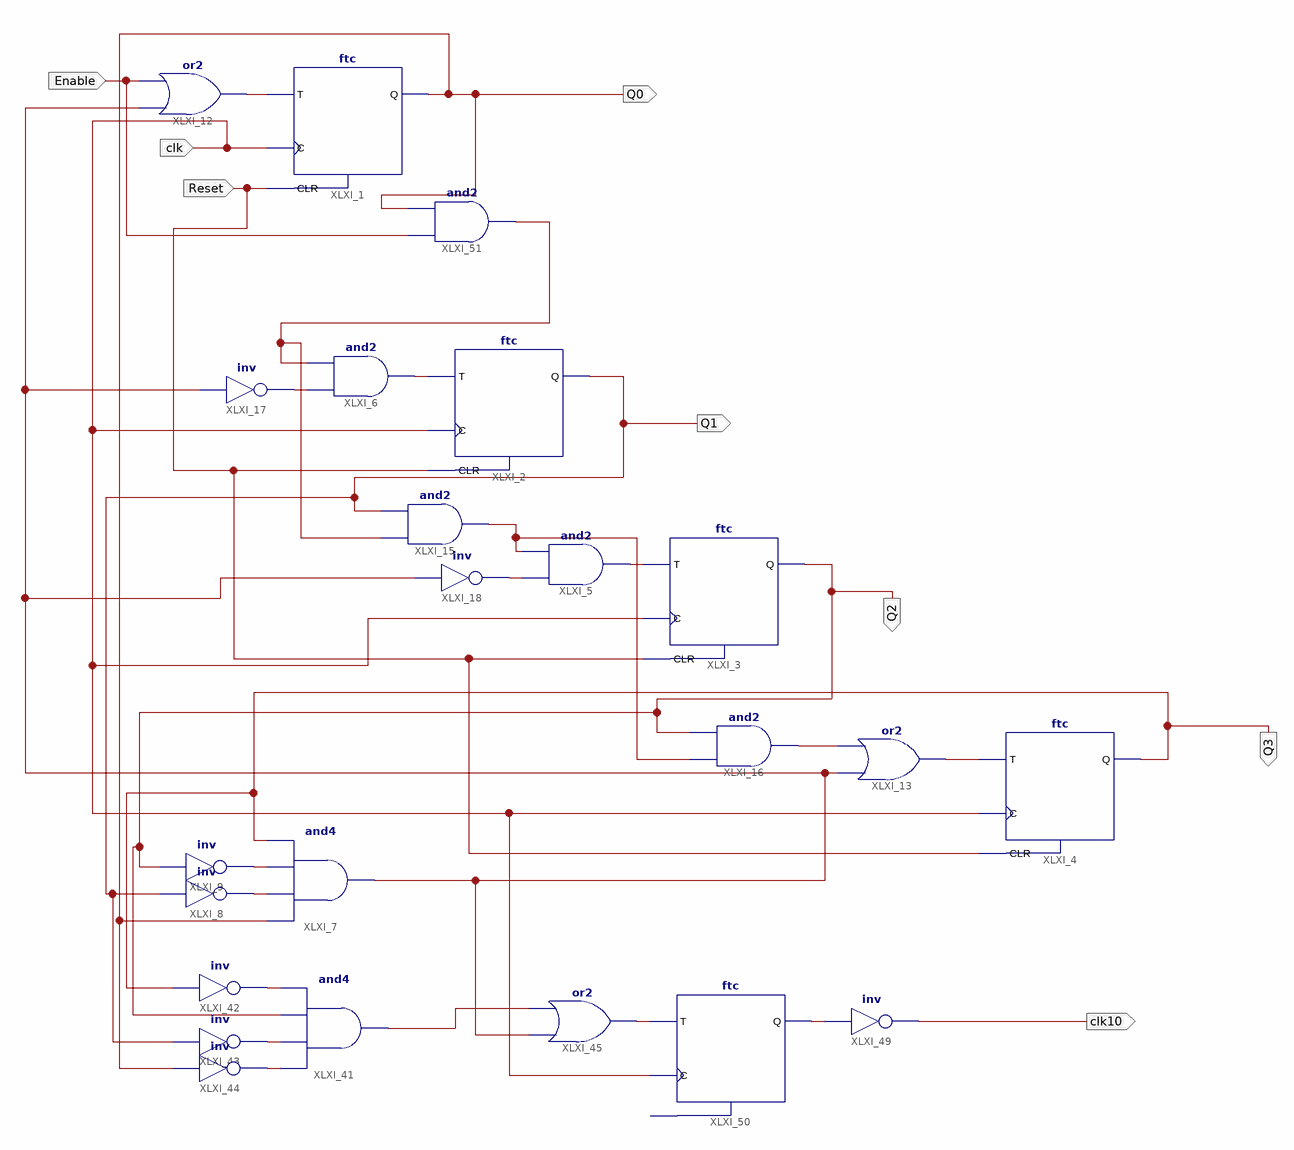
[diagram p0: schematic sheet 1]
// Xilinx ISE schematic Modulo10.sch (spartan6) as structural Verilog: 23 symbols, 8 ports
module Modulo10 (
  input  Enable,
  input  clk,
  input  Reset,
  output Q1,
  output Q3,
  output Q2,
  output clk10,
  output Q0
);

  wire EoC, XLXN_1, XLXN_2, XLXN_5, XLXN_6, XLXN_10, XLXN_11, XLXN_15, XLXN_16, XLXN_19, XLXN_21, XLXN_75,
       XLXN_76, XLXN_77, XLXN_85, XLXN_86, XLXN_87, XLXN_91;

  and XLXI_7 (EoC, Q0, XLXN_1, XLXN_2, Q3);
  not XLXI_8 (XLXN_1, Q1);
  not XLXI_9 (XLXN_2, Q2);
  ftc XLXI_1 (.C(clk), .CLR(Reset), .T(XLXN_5), .Q(Q0));
  ftc XLXI_2 (.C(clk), .CLR(Reset), .T(XLXN_11), .Q(Q1));
  ftc XLXI_3 (.C(clk), .CLR(Reset), .T(XLXN_10), .Q(Q2));
  ftc XLXI_4 (.C(clk), .CLR(Reset), .T(XLXN_6), .Q(Q3));
  or XLXI_13 (XLXN_6, EoC, XLXN_16);
  and XLXI_5 (XLXN_10, XLXN_21, XLXN_15);
  and XLXI_6 (XLXN_11, XLXN_19, XLXN_91);
  or XLXI_12 (XLXN_5, EoC, Enable);
  and XLXI_16 (XLXN_16, XLXN_15, Q2);
  not XLXI_17 (XLXN_19, EoC);
  and XLXI_15 (XLXN_15, XLXN_91, Q1);
  not XLXI_18 (XLXN_21, EoC);
  and XLXI_41 (XLXN_86, XLXN_77, XLXN_76, Q2, XLXN_75);
  not XLXI_42 (XLXN_75, Q3);
  not XLXI_43 (XLXN_76, Q1);
  not XLXI_44 (XLXN_77, Q0);
  or XLXI_45 (XLXN_85, EoC, XLXN_86);
  not XLXI_49 (clk10, XLXN_87);
  ftc XLXI_50 (.C(clk), .T(XLXN_85), .Q(XLXN_87));  // open: CLR
  and XLXI_51 (XLXN_91, Enable, Q0);
endmodule
